# Altium project C.PrjPcb
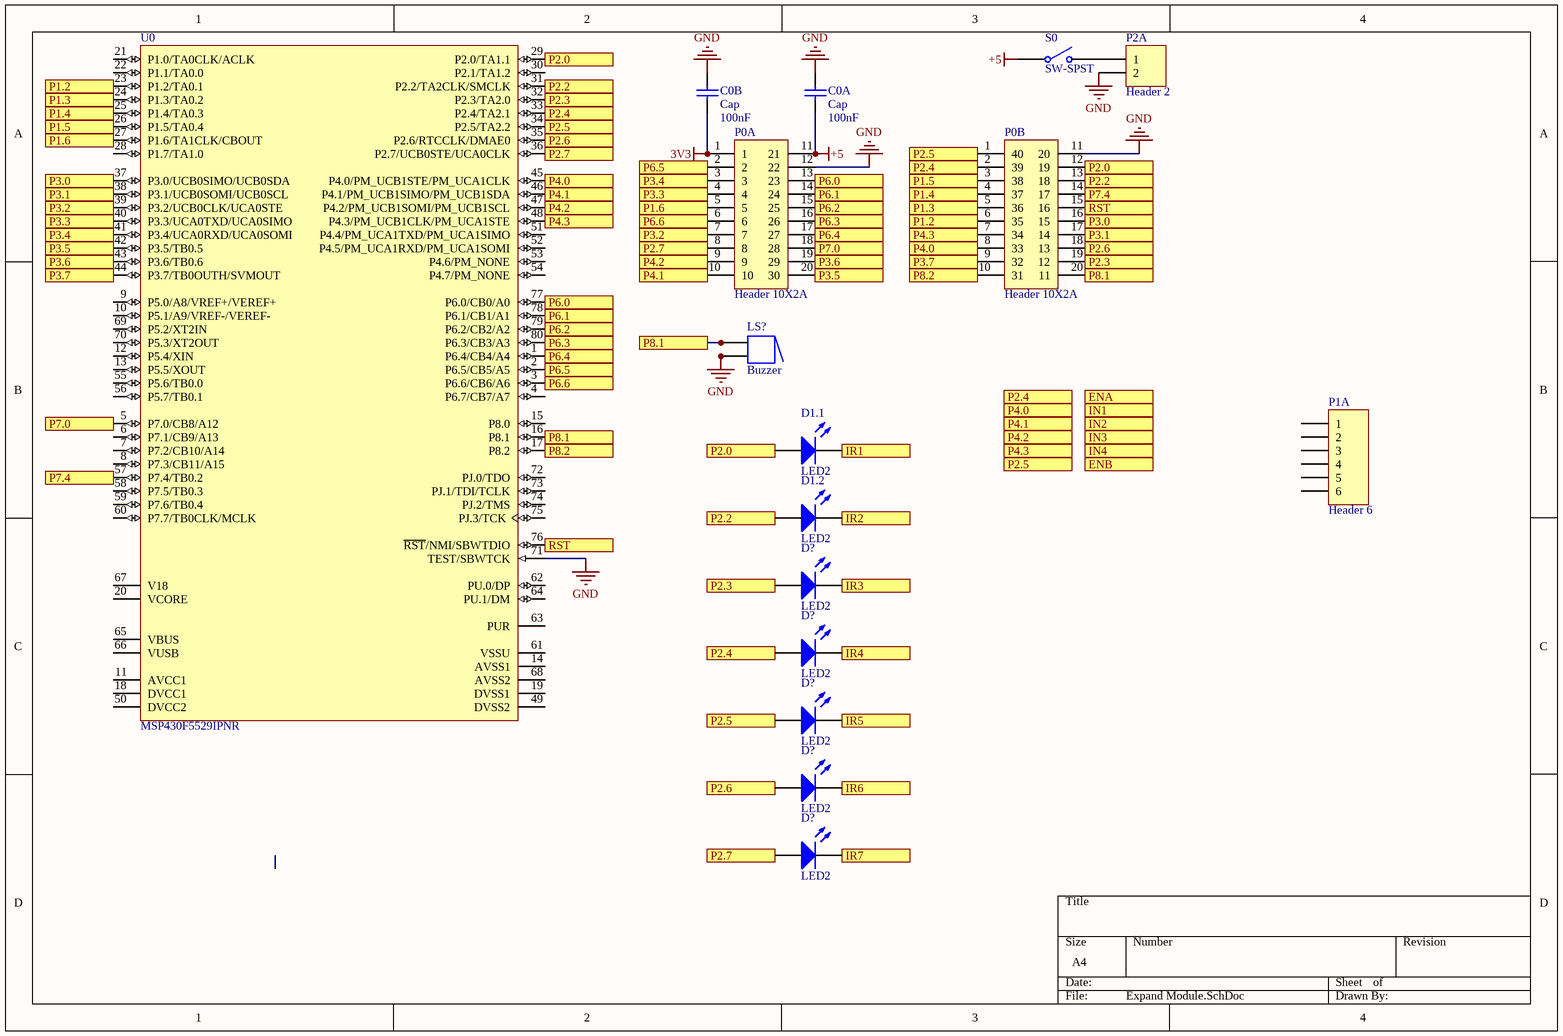
[diagram p0: Expand Module.SchDoc]
1 sheet, 16 parts. Net scope: flat (ports and power ports of the same name join across sheets).
Board file: Expand Module.PcbDoc

## Sheet Expand Module.SchDoc
size A4

### Parts
(Parts that share a designator on the sheet are numbered #1, #2 ... from top to bottom, then left to right.)
C0A  Cap  value 100nF  [RAD-0.3]
C0B  Cap  value 100nF  [RAD-0.3]
D1.1  LED2  [3.2X1.6X1.1]
D1.2  LED2  [3.2X1.6X1.1]
D?#1  LED2  [3.2X1.6X1.1]
D?#2  LED2  [3.2X1.6X1.1]
D?#3  LED2  [3.2X1.6X1.1]
D?#4  LED2  [3.2X1.6X1.1]
D?#5  LED2  [3.2X1.6X1.1]
LS?  Buzzer  [ABSM-1574]
P0A  Header 10X2A  [HDR2X10_CEN]
P0B  Header 10X2A  [HDR2X10_CEN]
P1A  Header 6  [HDR1X6]
P2A  Header 2  [HDR1X2]
S0  SW-SPST  [SPST-2]
U0  MSP430F5529IPNR  [PN0080A_M]

### Ports
ENA, ENB, IN1, IN2, IN3, IN4, IR1, IR2, IR3, IR4, IR5, IR6, IR7, P1.2, P1.3, P1.4, P1.5, P1.6, P2.0, P2.2, P2.3, P2.4, P2.5, P2.6, P2.7, P3.0, P3.1, P3.2, P3.3, P3.4, P3.5, P3.6, P3.7, P4.0, P4.1, P4.2, P4.3, P6.0, P6.1, P6.2, P6.3, P6.4, P6.5, P6.6, P7.0, P7.4, P8.1, P8.2, RST

### Nets
3V3: C0B.1 P0A.1
+5: C0A.1 P0A.11(21) S0.1(COMMON)
GND: C0A.2 C0B.2 LS?.2 LS?.2A P0A.12(22) P0B.11(20) P2A.2 U0.71(TEST/SBWTCK)
NetD1.1_1: D1.1.1(A) P0B.12(19) U0.29(P2.0/TA1.1) ; port P2.0
NetD1.1_2: D1.1.2(K) ; port IR1
NetD1.2_1: D1.2.1(A) P0B.13(18) U0.31(P2.2/TA2CLK/SMCLK) ; port P2.2
NetD1.2_2: D1.2.2(K) ; port IR2
NetD?#1_1: D?#1.1(A) P0B.19(12) U0.32(P2.3/TA2.0) ; port P2.3
NetD?#1_2: D?#1.2(K) ; port IR3
NetD?#2_1: D?#2.1(A) P0B.2(39) U0.33(P2.4/TA2.1) ; port P2.4
NetD?#2_2: D?#2.2(K) ; port IR4
NetD?#3_1: D?#3.1(A) P0B.1(40) U0.34(P2.5/TA2.2) ; port P2.5
NetD?#3_2: D?#3.2(K) ; port IR5
NetD?#4_1: D?#4.1(A) P0B.18(13) U0.35(P2.6/RTCCLK/DMAE0) ; port P2.6
NetD?#4_2: D?#4.2(K) ; port IR6
NetD?#5_1: D?#5.1(A) P0A.8 U0.36(P2.7/UCB0STE/UCA0CLK) ; port P2.7
NetD?#5_2: D?#5.2(K) ; port IR7
NetLS?_1: LS?.1 LS?.1A P0B.20(11) U0.16(P8.1) ; port P8.1
NetP0A_2: P0A.2 U0.2(P6.5/CB5/A5) ; port P6.5
NetP0A_3: P0A.3 U0.41(P3.4/UCA0RXD/UCA0SOMI) ; port P3.4
NetP0A_4: P0A.4 U0.40(P3.3/UCA0TXD/UCA0SIMO) ; port P3.3
NetP0A_5: P0A.5 U0.27(P1.6/TA1CLK/CBOUT) ; port P1.6
NetP0A_6: P0A.6 U0.3(P6.6/CB6/A6) ; port P6.6
NetP0A_7: P0A.7 U0.39(P3.2/UCB0CLK/UCA0STE) ; port P3.2
NetP0A_9: P0A.9 U0.47(P4.2/PM_UCB1SOMI/PM_UCB1SCL) ; port P4.2
NetP0A_10: P0A.10 U0.46(P4.1/PM_UCB1SIMO/PM_UCB1SDA) ; port P4.1
NetP0A_13: P0A.13(23) U0.77(P6.0/CB0/A0) ; port P6.0
NetP0A_14: P0A.14(24) U0.78(P6.1/CB1/A1) ; port P6.1
NetP0A_15: P0A.15(25) U0.79(P6.2/CB2/A2) ; port P6.2
NetP0A_16: P0A.16(26) U0.80(P6.3/CB3/A3) ; port P6.3
NetP0A_17: P0A.17(27) U0.1(P6.4/CB4/A4) ; port P6.4
NetP0A_18: P0A.18(28) U0.5(P7.0/CB8/A12) ; port P7.0
NetP0A_19: P0A.19(29) U0.43(P3.6/TB0.6) ; port P3.6
NetP0A_20: P0A.20(30) U0.42(P3.5/TB0.5) ; port P3.5
NetP0B_3: P0B.3(38) U0.26(P1.5/TA0.4) ; port P1.5
NetP0B_4: P0B.4(37) U0.25(P1.4/TA0.3) ; port P1.4
NetP0B_5: P0B.5(36) U0.24(P1.3/TA0.2) ; port P1.3
NetP0B_6: P0B.6(35) U0.23(P1.2/TA0.1) ; port P1.2
NetP0B_7: P0B.7(34) U0.48(P4.3/PM_UCB1CLK/PM_UCA1STE) ; port P4.3
NetP0B_8: P0B.8(33) U0.45(P4.0/PM_UCB1STE/PM_UCA1CLK) ; port P4.0
NetP0B_9: P0B.9(32) U0.44(P3.7/TB0OUTH/SVMOUT) ; port P3.7
NetP0B_10: P0B.10(31) U0.17(P8.2) ; port P8.2
NetP0B_14: P0B.14(17) U0.57(P7.4/TB0.2) ; port P7.4
NetP0B_15: P0B.15(16) U0.76(~{RST}/NMI/SBWTDIO) ; port RST
NetP0B_16: P0B.16(15) U0.37(P3.0/UCB0SIMO/UCB0SDA) ; port P3.0
NetP0B_17: P0B.17(14) U0.38(P3.1/UCB0SOMI/UCB0SCL) ; port P3.1
NetP2A_1: P2A.1 S0.2(NO)

Not connected (* = marked no-connect by the designer): P1A 1 2 3 4 5 6; U0 4(P6.7/CB7/A7) 6(P7.1/CB9/A13) 7(P7.2/CB10/A14) 8(P7.3/CB11/A15) 9(P5.0/A8/VREF+/VEREF+) 10(P5.1/A9/VREF-/VEREF-) 11(AVCC1) 12(P5.4/XIN) 13(P5.5/XOUT) 14(AVSS1) 15(P8.0) 18(DVCC1) 19(DVSS1) 20(VCORE) 21(P1.0/TA0CLK/ACLK) 22(P1.1/TA0.0) 28(P1.7/TA1.0) 30(P2.1/TA1.2) 49(DVSS2) 50(DVCC2) 51(P4.4/PM_UCA1TXD/PM_UCA1SIMO) 52(P4.5/PM_UCA1RXD/PM_UCA1SOMI) 53(P4.6/PM_NONE) 54(P4.7/PM_NONE) 55(P5.6/TB0.0) 56(P5.7/TB0.1) 58(P7.5/TB0.3) 59(P7.6/TB0.4) 60(P7.7/TB0CLK/MCLK) 61(VSSU) 62(PU.0/DP) 63(PUR) 64(PU.1/DM) 65(VBUS) 66(VUSB) 67(V18) 68(AVSS2) 69(P5.2/XT2IN) 70(P5.3/XT2OUT) 72(PJ.0/TDO) 73(PJ.1/TDI/TCLK) 74(PJ.2/TMS) 75(PJ.3/TCK)

### Library data of the parts
C0A C0B = Cap: Capacitor; Published: 8-Jun-2000; LatestRevisionDate: 17-Jul-2002; LatestRevisionNote: Re-released for DXP Platform.; PackageReference: RAD-0.3; Publisher: Altium Limited; PackageDescription: Radial Cap, Thru-Hole; 2 Leads; 0.3 in Pin Spacing
D1.1 D1.2 D?#1-D?#5 = LED2: Typical RED, GREEN, YELLOW, AMBER GaAs LED; Published: 8-Jun-2000; LatestRevisionDate: 17-Jul-2002; LatestRevisionNote: Re-released for DXP Platform.; PackageVersion: Feb-2002; PackageReference: 3.2X1.6X1.1; Publisher: Altium Limited; PackageDescription: SM LED; 2 Flat Leads
LS? = Buzzer: Magnetic Transducer Buzzer; Published: 24-Mar-1999; LatestRevisionDate: 17-Dec-2003; LatestRevisionNote: Schematic revised, PCB Footprint replaced.; DatasheetVersion: 17-Dec-2003; PackageReference: ABSM-1574; Publisher: Altium Limited; PackageDescription: Magnetic Transducer Buzzer; ComponentLink1Description: Manufacturer Link; ComponentLink1URL: http://www.megastar.com/linecard/buzzmode/index.php
P0A P0B = Header 10X2A: Header, 10-Pin, Dual row; LatestRevisionDate: 17-Jul-2002; LatestRevisionNote: Re-released for DXP Platform.; Publisher: Altium Limited
P1A = Header 6: Header, 6-Pin; LatestRevisionDate: 17-Jul-2002; LatestRevisionNote: Re-released for DXP Platform.; Publisher: Altium Limited
P2A = Header 2: Header, 2-Pin; LatestRevisionDate: 17-Jul-2002; LatestRevisionNote: Re-released for DXP Platform.; Publisher: Altium Limited
S0 = SW-SPST: Single-Pole, Single-Throw Switch; Published: 24-Mar-1999; LatestRevisionDate: 17-Jul-2002; LatestRevisionNote: Re-released for DXP Platform.; PackageReference: SPST-2; Publisher: Altium Limited; PackageDescription: Switch; 2 Leads
U0 = CMP-0365-00413-2: 25 MHz Mixed Signal Microcontroller with 128 KB Flash, 8192 B SRAM and 63 GPIOs, -40 to 85 degC, 80-pin QFP (PN), Green (RoHS & no Sb/Br); Manufacturer: Texas Instruments; Flash(KB): 128; ADC Channels: 16; Temp Sensor: Yes; SubFamily: 5 Series; Frequency(MHz): 25; Multiplier: 32x32; DMA: 3; USB: 1; SRAM(B): 8192; GPIO: 63; USCI_A (UART/LIN/IrDA/SPI): 2; ADC: 12-bit SAR; Timers - 16-bit: 4; ComponentLink1URL: http://www.ti.com/; ComponentLink2URL: http://www.ti.com/general/docs/lit/getliterature.tsp?genericPartNumber=MSP430F5529&fileType=pdf; DatasheetVersion: SLAS590I; ComponentLink2Description: Datasheet; ComponentLink3URL: http://www.ti.com/lit/ml/mtqf010a/mtqf010a.pdf; Watchdog: Yes; Brown Out Reset: Yes; PartNumber: MSP430F5529IPNR; Comparators: Yes; Code_JEDEC: MS-018; PackageReference: PN0080A; ComponentLink1Description: Manufacturer URL; Eco-Plan: Green (RoHS & no Sb/Br); SVS: Yes; USCI_B (I2C & SPI): 2; Mounting Technology: Surface Mount; Real-Time Clock: Yes; ComponentLink3Description: Package Specification; PackageDescription: 80-Pin Plastic Quad Flat Pack, Body 12 x 12 mm, Pitch 0.5 mm